# EAGLE design airu-bb (EAGLE 7.1.0)
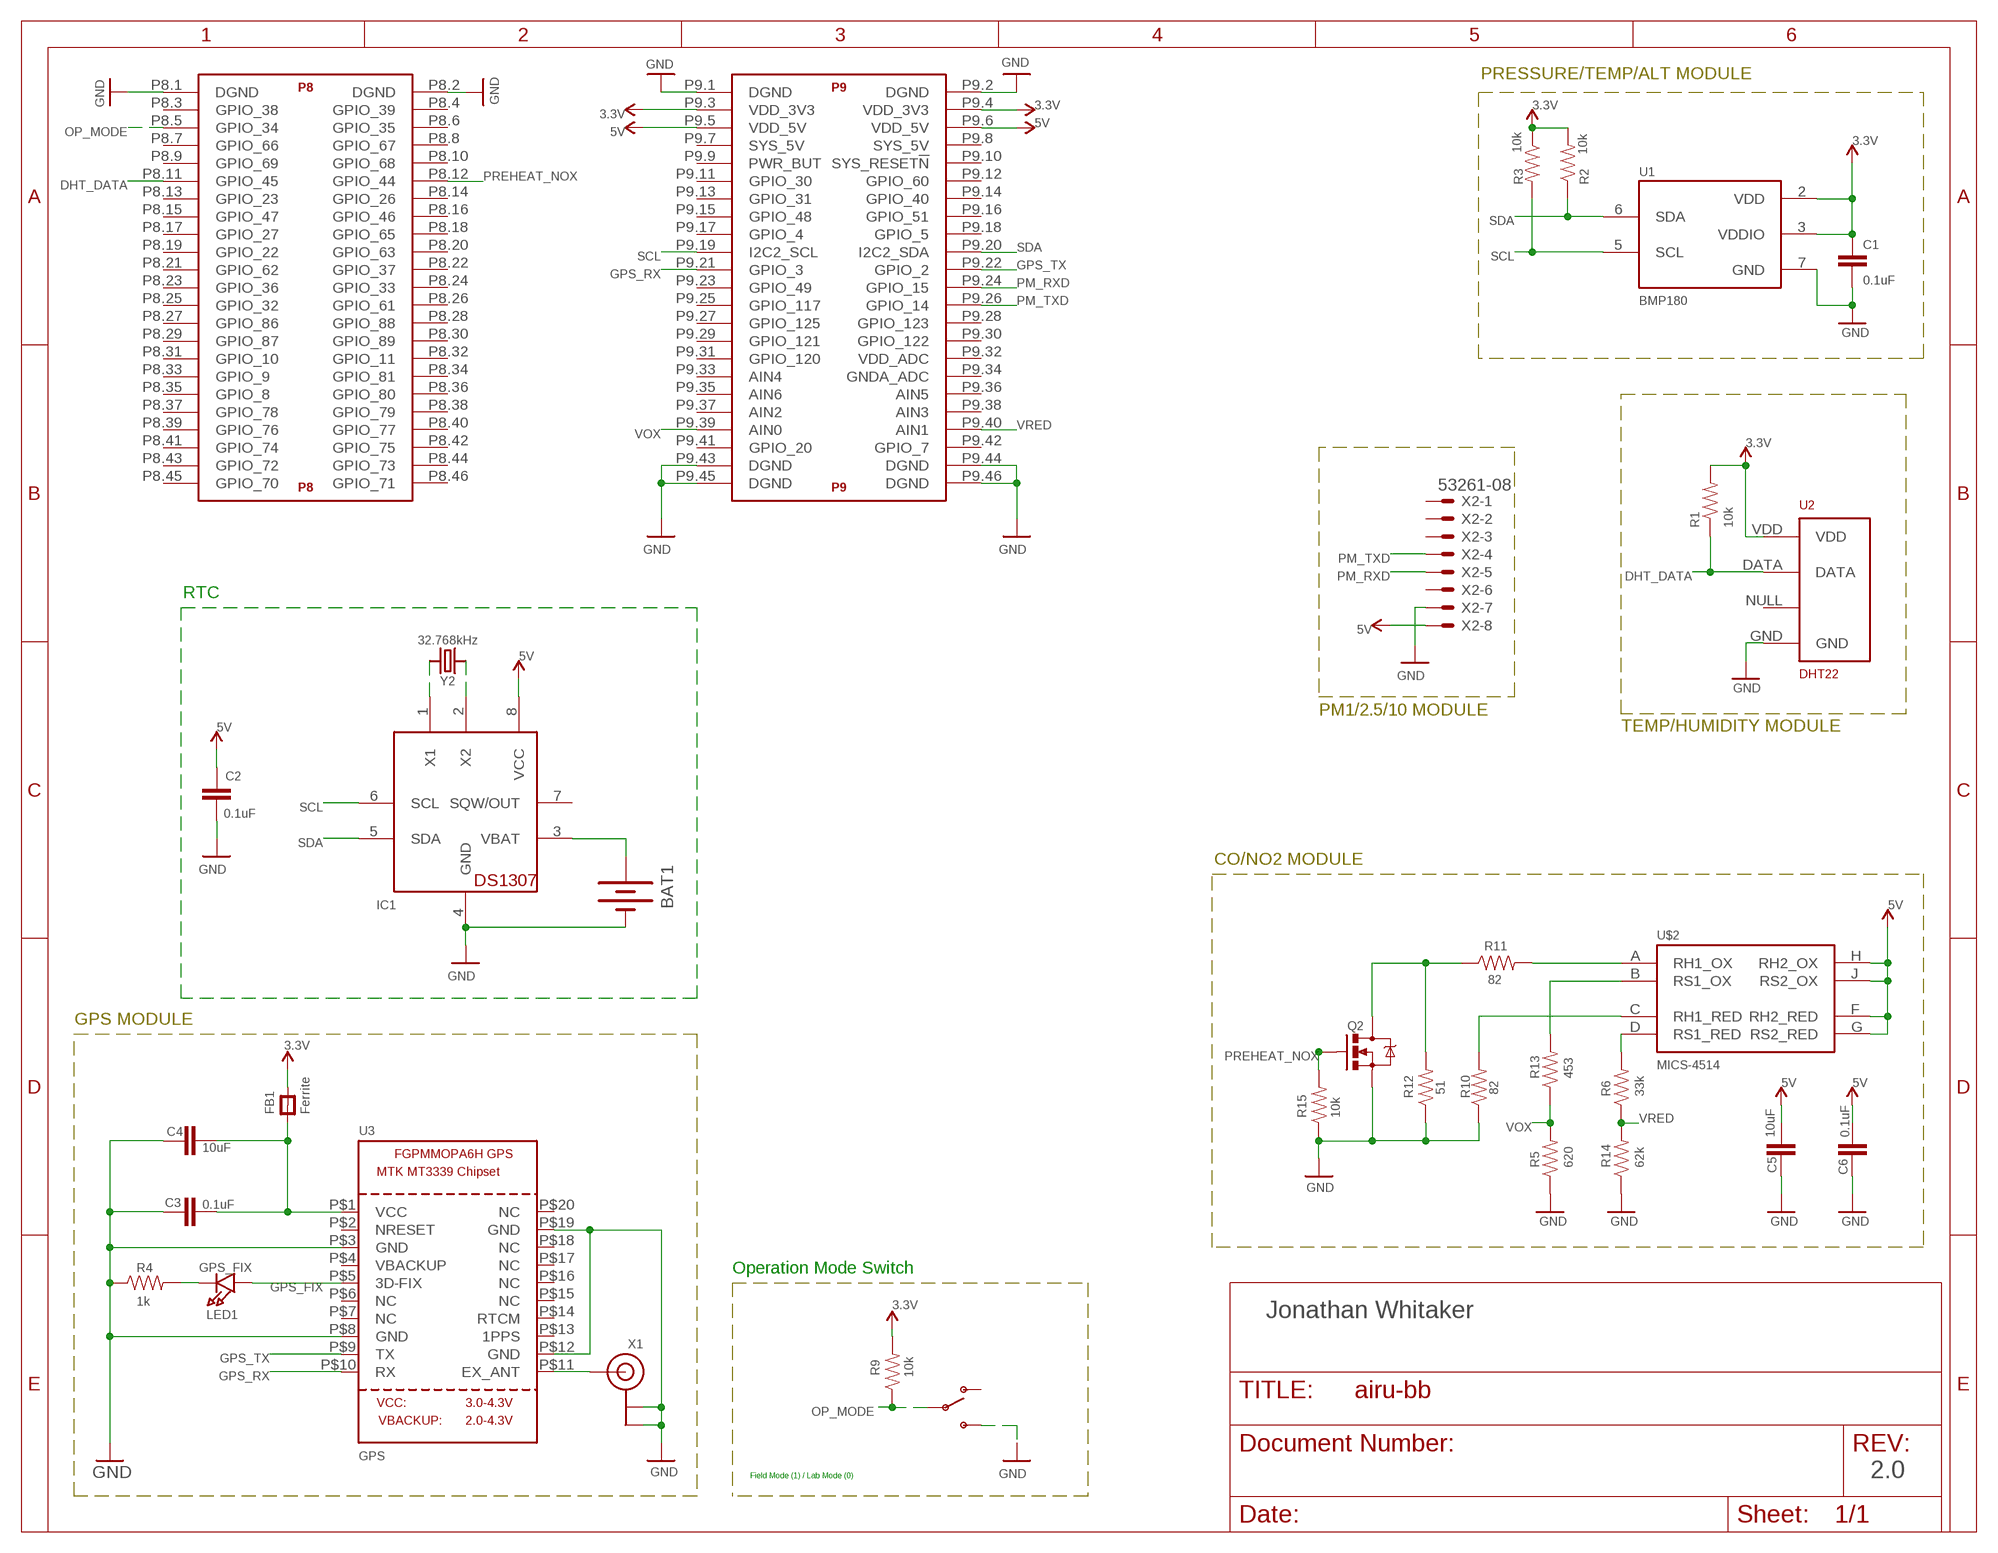
[diagram p0: schematic, sheet 1]

## Parts
BAT1  BATTERY20SMD  [BATTCON_20MM]
C1  0.1uF  CAP1206  [1206]
C2  0.1uF  CAP1206  [1206]
C3  0.1uF  CAP1206  [1206]
C4  10uF  CAP1206  [1206]
C5  10uF  CAP1206  [1206]
C6  0.1uF  CAP1206  [1206]
FB1  Ferrite  FERRITE0805  [0805]
IC1  DS1307  [DIL08]
LED1  GPS_FIX  LED1206  [CHIPLED_1206]
Q2  MOSFET-NCHANNELAO3404A  [SOT23-3]
R1  10k  RESISTOR1206  [1206]
R2  10k  RESISTOR1206  [1206]
R3  10k  RESISTOR1206  [1206]
R4  1k  RESISTOR1206  [1206]
R5  620  RESISTOR1206  [1206]
R6  33k  RESISTOR1206  [1206]
R9  10k  RESISTOR1206  [1206]
R10  82  RESISTOR1206  [1206]
R11  82  RESISTOR1206  [1206]
R12  51  RESISTOR1206  [1206]
R13  453  RESISTOR1206  [1206]
R14  62k  RESISTOR1206  [1206]
R15  10k  RESISTOR1206  [1206]
U1  BMP180  [BMP180]
U2  DHT22  RHT03_DHT-22_AM2302  [RHT03_DHT-22]
U3  GPS  GPS_FGPMMOPA6H  [FGPMMOPA6H]
U$1  BEAGLE_BONE_BLACK_CAPE  [BEAGLE_BONE_BLACK_CAPE]
U$2  MICS-4514  [MICS_10-SMD]
U$3  SWITCH_SPDT  [KPS-1290]
X1  ANTENNA_U.FL  [U.FL]
X2  53261-08  [53261-08]
Y2  32.768kHz  FX12232.768KHZ  [2-SMD]

## Nets
3.3V: C1.1 FB1.2 R1.2 R2.2 R3.1 R9.2 U1.2(VDD) U1.3(VDDIO) U2.VDD U$1.P9.3(P9:VDD_3V3) U$1.P9.4(P9:VDD_3V3) ; supply symbol labelled VCC
5V: C2.2 C5.2 C6.2 IC1.8(VCC) U$1.P9.5(P9:VDD_5V) U$1.P9.6(P9:VDD_5V) U$2.F(RH2_RED) U$2.G(RS2_RED) U$2.H(RH2_OX) U$2.J(RS2_OX) X2.8 ; supply symbol labelled VCC
DHT_DATA [DHT22 GND]: R1.1 U2.DATA U$1.P8.11(P8:GPIO_45)
GND [DHT22 GND]: BAT1.2(-) C1.2 C2.1 C3.1 C4.1 C5.1 C6.1 IC1.4(GND) Q2.2(S) R4.1 R5.1 R10.1 R12.1 R14.1 R15.1 U1.7(GND) U2.GND U3.P$3(GND) U3.P$8(GND) U3.P$12(GND) U3.P$19(GND) U$1.P8.1(P8:DGND) U$1.P8.2(P8:DGND) U$1.P9.1(P9:DGND) U$1.P9.2(P9:DGND) U$1.P9.43(P9:DGND) U$1.P9.44(P9:DGND) U$1.P9.45(P9:DGND) U$1.P9.46(P9:DGND) U$3.S X1.1(GND) X1.2(GND) X2.7
GPS_FIX: LED1.A U3.P$5(3D-FIX)
GPS_RX: U3.P$10(RX) U$1.P9.21(P9:GPIO_3)
GPS_TX: U3.P$9(TX) U$1.P9.22(P9:GPIO_2)
N$1: C3.2 C4.2 FB1.1 U3.P$1(VCC)
N$2: U3.P$11(EX_ANT) X1.3(SIGNAL)
N$3: LED1.C R4.2
N$4: R10.2 U$2.C(RH1_RED)
N$6: R13.2 U$2.B(RS1_OX)
N$7: Q2.3(D) R11.1 R12.2
N$8: R6.2 U$2.D(RS1_RED)
N$9: R11.2 U$2.A(RH1_OX)
N$11: BAT1.1(+) IC1.3(VBAT)
N$12: IC1.1(X1) Y2.1
N$14: IC1.2(X2) Y2.2
OP_MODE: R9.1 U$1.P8.5(P8:GPIO_34) U$3.P
PM_RXD: U$1.P9.24(P9:GPIO_15) X2.5
PM_TXD: U$1.P9.26(P9:GPIO_14) X2.4
PREHEAT_NOX: Q2.1(G) R15.2 U$1.P8.12(P8:GPIO_44)
SCL: IC1.6(SCL) R3.2 U1.5(SCL) U$1.P9.19(P9:I2C2_SCL)
SDA [BMP180 SCL/SDA]: IC1.5(SDA) R2.1 U1.6(SDA) U$1.P9.20(P9:I2C2_SDA)
VOX: R5.2 R13.1 U$1.P9.39(P9:AIN0)
VRED: R6.1 R14.2 U$1.P9.40(P9:AIN1)
Unconnected: IC1.7(SQW/OUT) U2.NULL U3.P$2(NRESET) U3.P$4(VBACKUP) U3.P$6(NC) U3.P$7(NC) U3.P$13(1PPS) U3.P$14(RTCM) U3.P$15(NC) U3.P$16(NC) U3.P$17(NC) U3.P$18(NC) U3.P$20(NC) U$1.P8.3(P8:GPIO_38) U$1.P8.4(P8:GPIO_39) U$1.P8.6(P8:GPIO_35) U$1.P8.7(P8:GPIO_66) U$1.P8.8(P8:GPIO_67) U$1.P8.9(P8:GPIO_69) U$1.P8.10(P8:GPIO_68) U$1.P8.13(P8:GPIO_23) U$1.P8.14(P8:GPIO_26) U$1.P8.15(P8:GPIO_47) U$1.P8.16(P8:GPIO_46) U$1.P8.17(P8:GPIO_27) U$1.P8.18(P8:GPIO_65) U$1.P8.19(P8:GPIO_22) U$1.P8.20(P8:GPIO_63) U$1.P8.21(P8:GPIO_62) U$1.P8.22(P8:GPIO_37) U$1.P8.23(P8:GPIO_36) U$1.P8.24(P8:GPIO_33) U$1.P8.25(P8:GPIO_32) U$1.P8.26(P8:GPIO_61) U$1.P8.27(P8:GPIO_86) U$1.P8.28(P8:GPIO_88) U$1.P8.29(P8:GPIO_87) U$1.P8.30(P8:GPIO_89) U$1.P8.31(P8:GPIO_10) U$1.P8.32(P8:GPIO_11) U$1.P8.33(P8:GPIO_9) U$1.P8.34(P8:GPIO_81) U$1.P8.35(P8:GPIO_8) U$1.P8.36(P8:GPIO_80) U$1.P8.37(P8:GPIO_78) U$1.P8.38(P8:GPIO_79) U$1.P8.39(P8:GPIO_76) U$1.P8.40(P8:GPIO_77) U$1.P8.41(P8:GPIO_74) U$1.P8.42(P8:GPIO_75) U$1.P8.43(P8:GPIO_72) U$1.P8.44(P8:GPIO_73) U$1.P8.45(P8:GPIO_70) U$1.P8.46(P8:GPIO_71) U$1.P9.7(P9:SYS_5V) U$1.P9.8(P9:SYS_5V) U$1.P9.9(P9:PWR_BUT) U$1.P9.10(P9:SYS_RESET!N) U$1.P9.11(P9:GPIO_30) U$1.P9.12(P9:GPIO_60) U$1.P9.13(P9:GPIO_31) U$1.P9.14(P9:GPIO_40) U$1.P9.15(P9:GPIO_48) U$1.P9.16(P9:GPIO_51) U$1.P9.17(P9:GPIO_4) U$1.P9.18(P9:GPIO_5) U$1.P9.23(P9:GPIO_49) U$1.P9.25(P9:GPIO_117) U$1.P9.27(P9:GPIO_125) U$1.P9.28(P9:GPIO_123) U$1.P9.29(P9:GPIO_121) U$1.P9.30(P9:GPIO_122) U$1.P9.31(P9:GPIO_120) U$1.P9.32(P9:VDD_ADC) U$1.P9.33(P9:AIN4) U$1.P9.34(P9:GNDA_ADC) U$1.P9.35(P9:AIN6) U$1.P9.36(P9:AIN5) U$1.P9.37(P9:AIN2) U$1.P9.38(P9:AIN3) U$1.P9.41(P9:GPIO_20) U$1.P9.42(P9:GPIO_7) U$3.O X2.1 X2.2 X2.3 X2.6

## Notes on the sheet
- PRESSURE/TEMP/ALT MODULE
- RTC
- PM1/2.5/10 MODULE
- TEMP/HUMIDITY MODULE
- CO/NO2 MODULE
- GPS MODULE
- Operation Mode Switch
- Jonathan Whitaker
- Field Mode (1) / Lab Mode (0) | 2.0

## Library data of the parts
BAT1 = SparkFun-Electromechanical:BATTERY: Battery Holders Various common sizes : AA, AAA, 18650 (PRT-12895), 20mm coin cell and 12mm coin cell. 20MM_4LEGS, BATT-10373
C1-C6 = SparkFun-Passives:CAP: Capacitor Standard 0603 ceramic capacitor, and 0.1" leaded capacitor.
FB1 = microbuilder:FERRITE: Ferrite Bead 0603 MMZ1608B121C - 120 Ohm @ 100MHz, 600mA, 0.15 Ohm DC Resistance - Digikey: 445-2164-1-ND BK1608HW121-T - 120 Ohm, 600mA Ferrite Chip - Digikey: 587-1876-2-ND 0805 HZ0805B272R-10 - 2.7K Ohm @ 100MHz, 200mA, 0.8 Ohm DC Resistance - Digikey: 240-2504-1-ND (see also Murata BLM21BD272SN1L) MMZ2012Y152B - 1.5K Ohm @ 100MHz, 500mA, 0.4 Ohm DC Resistance - Digikey: 445-1560-1-ND - Mainly for high frequency (80-400MHz) MMZ2012R102A - 1K Ohm @ 100MHz, 500mA, 0.3 Ohm DC Resistance - Digikey: 445-1555-2-ND - More general purpose (10-200MHz)
IC1 = adafruit:DS1307: DS1307 Real time clock (RTC) with battery backup ability. Talk to it via i2c
LED1 = microbuilder:LED: LED 0603 - 0603 Surface Mount Package 2mA: Green LED - Low Power (3.9mcd, 2ma, 1.7Vf) - Digikey: 475-2709-2-ND Orange LED - Low Power (9.8mcd, 2ma, 1.8Vf) - Digikey: 475-1194-2-ND Red LED - Low Power (5mcd, 2ma, 1.8Vf) - Digikey: 475-1195-2-ND Yellow LED - Low Power (7mcd, 2ma, 1.8Vf) - Digikey: 475-1196-2-ND 5mA: Blue LED - Low Power (17mcd, 5ma, 2.9Vf) - Digikey: LNJ937W8CRACT-ND 0805 - 0805 Surface Mount Package 2mA: Red LED (8.8mcd, 2mA, 1.8Vf, Clear) - Low Power [Digikey: 475-2510-1-ND] Green LED (5mcd, 2mA, 1.8Vf, Clear) - Low Power [Digikey: 475-2730-1-ND] Yellow LED (11.3mcd, 2mA, 1.8Vf, Clear) - Low Power [Digikey: 475-2555-1-ND] 20mA: Red LED (104mcd, 20mA, Diffused) - LS R976 [Digikey: 475-1278-6-ND] Red LED (12mcd, 20mA, 2.0Vf, Clear) - APT2012EC [Digikey: 754-1128-1-ND] Green LED (15mcd, 20mA, 2.2Vf, Clear) - APT2012GC [Digikey: 754-1131-1-ND] Orange LED (160mcd, 20mA, 2.1Vf, Clear) - APT2012SECK [Digikey: 754-1130-1-ND] 1206 - 1206 Surface Mount Package Green LED (26mcd, 20mA, Diffused) - LG N971 [Digikey: 475-1407-6-ND] Red LED (15mcd, 20mA, Diffused) - LH N974 [Digikey: 475-1416-6-ND]
Q2 = SparkFun-DiscreteSemi:MOSFET-NCHANNEL: Common NMOSFET Parts MFG P/N Store ID Prod ID FDD8780 TRANS-09984 SI7820DN TRANS-11055 FDS6630A IC-08089 2N7002PW TRANS-11151 FQP30N06L COM-10213 TRANS-10060 BSS123LT1G TRANS-08345 BSS138 TRANS-00830 BS170 2N7000; PROD_ID: TRAN-12988
R1-R6 R9-R15 = SparkFun-Passives:RESISTOR: Resistor Basic schematic elements and footprints for 0603, 1206, and PTH resistors.
U1 = SparkFun-Sensors:BMP180: BOSCH BMP180 DIGITAL BAROMETRIC PRESSURE SENSOR Web page: http://www.bosch-sensortec.com/en/homepage/products_3/environmental_sensors_1/bmp180_1/bmp180 Datasheet: http://ae-bst.resource.bosch.com/media/products/dokumente/bmp180/BST-BMP180-DS000-09.pdf The BMP180 is the function compatible successor of the BMP085, a new generation of high precision digital pressure sensors for consumer applications. The ultra-low power, low voltage electronics of the BMP180 is optimized for use in mobile phones, PDAs, GPS navigation devices and outdoor equipment. With a low altitude noise of merely 0.25m at fast conversion time, the BMP180 offers superior performance. The I2C interface allows for easy system integration with a microcontroller. The BMP180 is based on piezo-resistive technology for EMC robustness, high accuracy and linearity as well as long term stability. Key features: - Temperature measurement included - I2C interface - Fully calibrated - Pb-free, halogen-free and RoHS compliant, - MSL 1 Basic specs: Pressure range: 300 to 1100hPa (+9000m to -500m relating to sea level) Supply voltage: 1.8 to 3.6V (VDD), 1.62V to 3.6V (VDDIO) Package: LGA package with metal lid Small footprint: 3.6mm x 3.8mm Super-flat: 0.93mm height Low power: 5μA at 1 sample / sec. in standard mode Low noise: 0.06hPa (0.5m) in ultra low power mode, 0.02hPa (0.17m) advanced resolution mode Typical applications: - Enhancement of GPS navigation (dead-reckoning, slope detection, etc.) - In- and out-door navigation - Leisure and sports - Weather forecast - Vertical velocity indication (rise/sink speed)
U2 = RHT03_DHT-22_AM2302:RHT03_DHT-22_AM2302: RHT03 / DHT-22 / AM2302 Packages and symbol for the RHT03 / DHT-22 relative humidity and temperature sensor. Note: The AM2302 is a wired version of the DHT-22 which typically requires less clearance and is thus provided as a separate package.; PROD_ID: SEN-10167
U3 = adafruit:GPS_FGPMMOPA6H: GPS Module - MTK MT3339 Chipset, -165dBm sensitivity, 22 channels, 10Hz, auto-select external antenna options
U$1 = SparkFun-Boards:BEAGLE_BONE_BLACK_CAPE
U$2 = SparkFun-Sensors:MICS-4514: Metal oxide MEMS carbon monoxide (CO) and NOx sensor in an SMD package.; PROD_ID: COMP-12310
U$3 = SparkFun-Electromechanical:SWITCH_SPDT: SWCH-10651 Side-actuated SPDT slide switch, as used on the Arduino Pro; PROD_ID: SWCH-10651
X1 = adafruit:ANTENNA_U.FL: U.FL Antenna Connector
X2 = con-molex:53?-08: CONNECTOR wire to board 1.25 mm (.049 inch) pitch header; OC_FARNELL: 1125376; OC_NEWARK: unknown
Y2 = Lowduino:FX122: FX122 - SMD 2.0 x 1.2 Tuning Fork Crystal Technical Specifications: Frequency: 32.768 kHz Frequency Tolerance @ 25ºC: ±20 PPM Frequency Stability Temperature Coefficient: -0.04 PPM / (ΔºC)^2 0.6mm Height Long Term Stability http://www.foxonline.com/pdfs/FX122.pdf; DIGIKEY: 631-1261-1-ND

## Net classes
0 default: width 0.254 mm
1 ground: width 0.457 mm
2 vcc: width 0.457 mm
3 BMP180 GND: width 0.152 mm, clearance 0.152 mm
4 BMP180 SCL/SDA: width 0.127 mm, clearance 0.127 mm
5 DHT22 GND: width 0.003 mm, clearance 0.127 mm

## Board
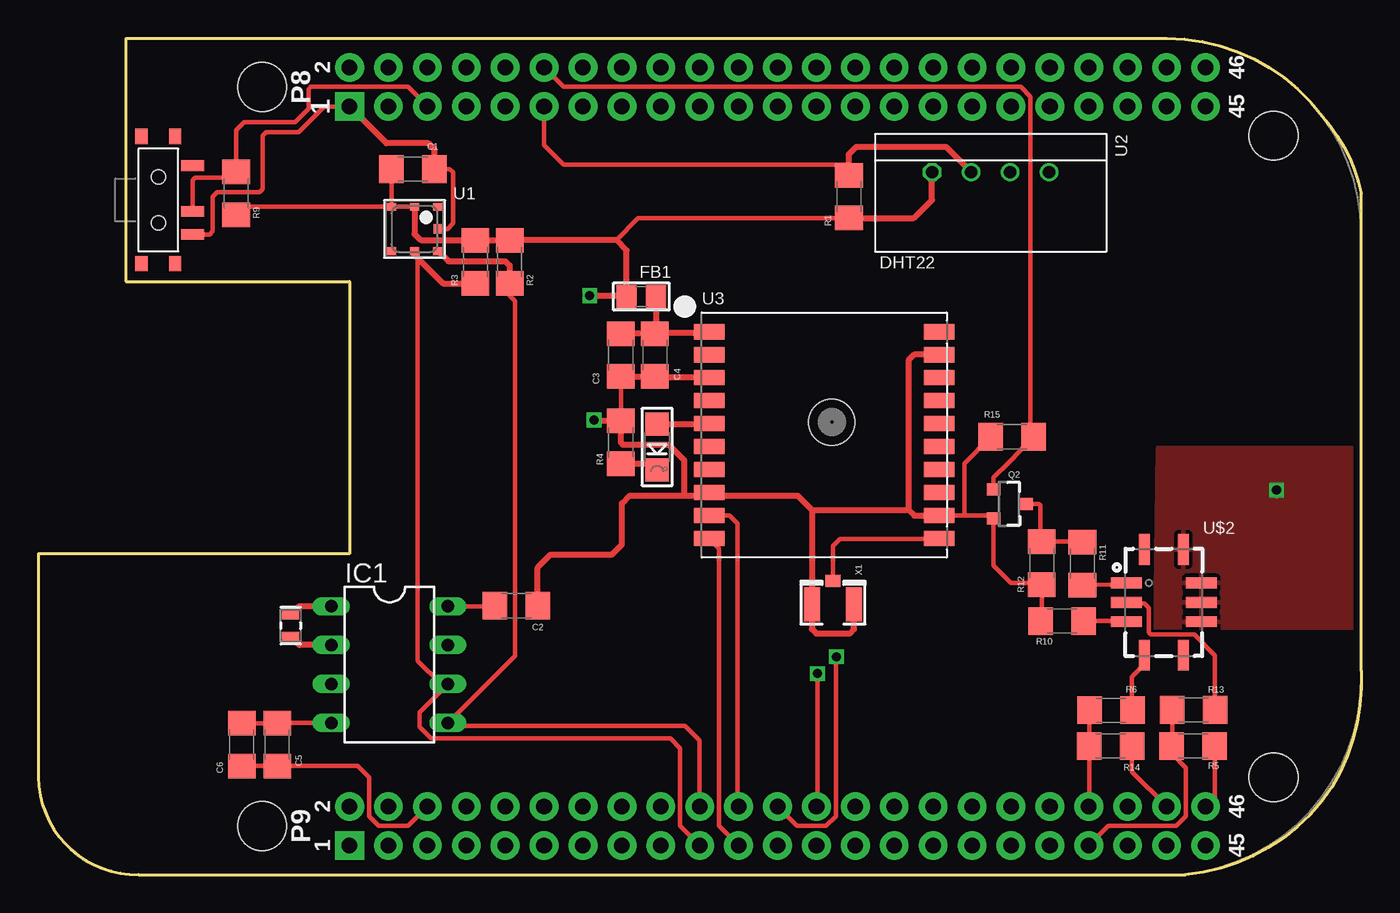
[diagram p1: board, top side]
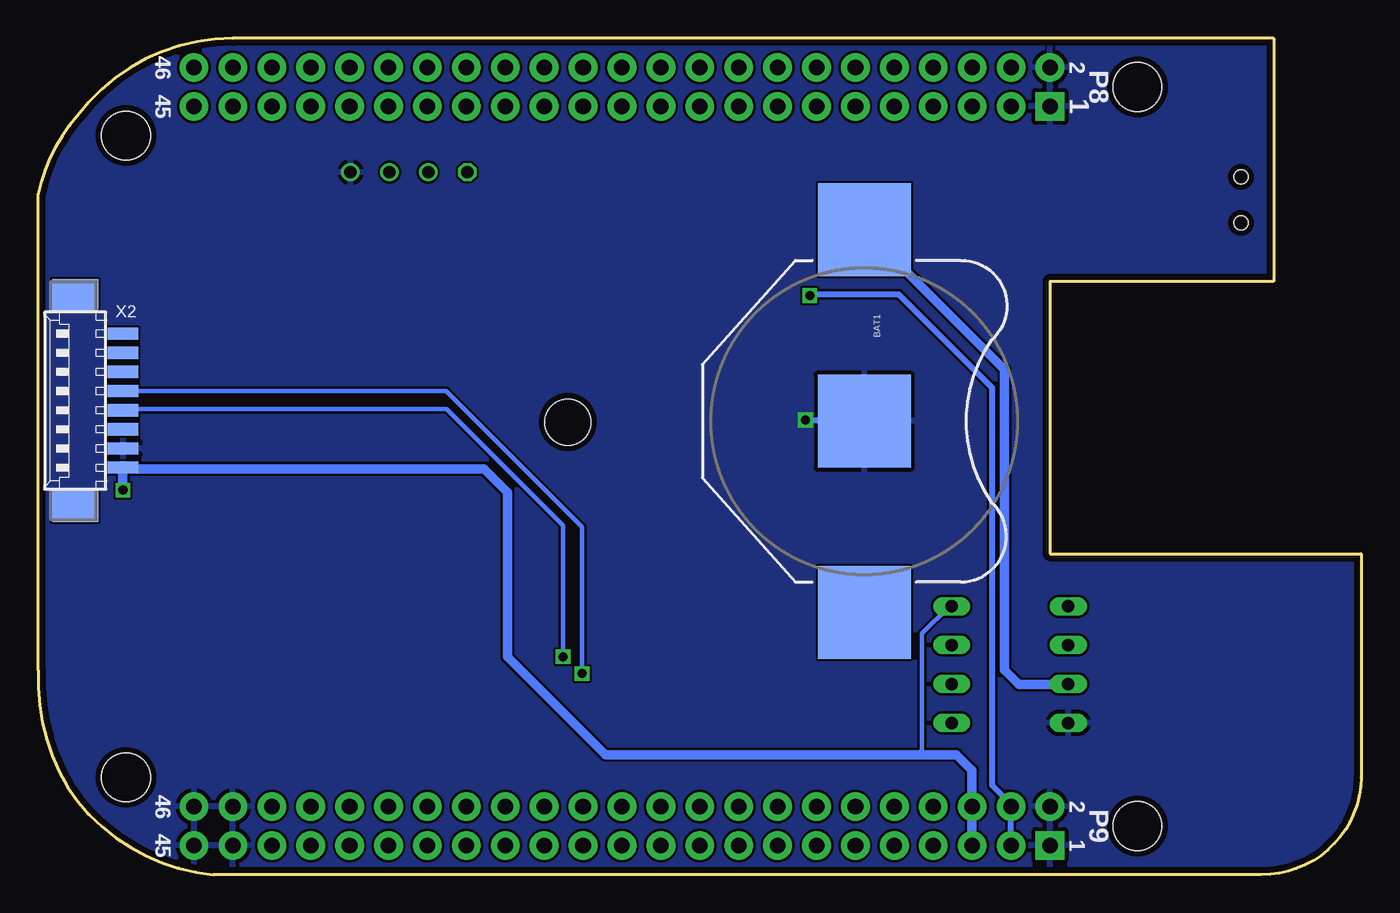
[diagram p2: board, bottom side, seen from below]

Size 86.37 x 54.61 mm. Coordinates in mm from the lower left corner, seen from the top.
Outline: 5.71,54.61 5.71,38.73 20.32,38.73 20.32,20.95 0,20.95 0,6.35 arc90 6.54,0 74.93,0 arc51 84.45,5.71 arc33 86.36,13.34 86.36,44.45 arc30 83.82,49.53 arc53 73.66,54.61 5.71,54.61
Copper layers (1*16): Top 0.0356mm / dielectric 1.5011mm / Bottom 0.0356mm
Design rules "osh-park": minimum track width 6mil, minimum drill 13mil, track to track 6mil, track to pad 6mil, pad to pad 6mil, via to via 6mil, smd to smd 6mil, copper to edge 15mil, drill to drill 6mil, minimum pad ring 7mil, minimum via ring 7mil, stop-mask expansion 3mil, vias tented up to drill 0mil, thermal gap 10mil

### Footprints (pad centres in the part's own frame; a part is rotated, then mirrored left to right if it is on the bottom)
BATTCON_20MM = smd 6.07 x 6.07: 1 -12.5,0; 2 0,0; 3 12.5,0
1206 = smd 1.6 x 1.8: 1 -1.4,0; 2 1.4,0
0805 = smd 1.3 x 1.5: 1 -0.95,0; 2 0.95,0
DIL08 = drill 0.813 long: 1 -3.81,-3.81; 2 -1.27,-3.81; 3 1.27,-3.81; 4 3.81,-3.81; 5 3.81,3.81; 6 1.27,3.81; 7 -1.27,3.81; 8 -3.81,3.81
CHIPLED_1206 = smd 1.5 x 1.5: A 0,-1.496; C 0,1.496
SOT23-3 = smd 0.8 x 0.9: 1 -0.95,-1; 2 0.95,-1; 3 0,1.1
BMP180 = smd 0.6 x 0.5: 1 1.5,1.45; 2 0,1.45; 3 -1.5,1.45; 4 -1.5,-1.45; 5 0,-1.45; 6 1.5,-1.45 | smd 0.5 x 0.6: 7 1.5,0
RHT03_DHT-22 = drill 0.8: DATA -1.27,0; GND 3.81,0; NULL 1.27,0 | drill 0.8 octagon: VDD -3.81,0
FGPMMOPA6H = smd 2 x 1: P$1 -7.5,6.75; P$2 -7.5,5.25; P$3 -7.5,3.75; P$4 -7.5,2.25; P$5 -7.5,0.75; P$6 -7.5,-0.75; P$7 -7.5,-2.25; P$8 -7.5,-3.75; P$9 -7.5,-5.25; P$10 -7.5,-6.75; P$11 7.5,-6.75; P$12 7.5,-5.25; P$13 7.5,-3.75; P$14 7.5,-2.25; P$15 7.5,-0.75; P$16 7.5,0.75; P$17 7.5,2.25; P$18 7.5,3.75; P$19 7.5,5.25; P$20 7.5,6.75 | hole 3: 0.5,0.85
BEAGLE_BONE_BLACK_CAPE = drill 1.016 pad 1.88 square: P8.1 20.32,50.165; P9.1 20.32,1.905 | drill 1.016 pad 1.88: P8.2 20.32,52.705; P8.3 22.86,50.165; P8.4 22.86,52.705; P8.5 25.4,50.165; P8.6 25.4,52.705; P8.7 27.94,50.165; P8.8 27.94,52.705; P8.9 30.48,50.165; P8.10 30.48,52.705; P8.11 33.02,50.165; P8.12 33.02,52.705; P8.13 35.56,50.165; P8.14 35.56,52.705; P8.15 38.1,50.165; P8.16 38.1,52.705; P8.17 40.64,50.165; P8.18 40.64,52.705; P8.19 43.18,50.165; P8.20 43.18,52.705; P8.21 45.72,50.165; P8.22 45.72,52.705; P8.23 48.26,50.165; P8.24 48.26,52.705; P8.25 50.8,50.165; P8.26 50.8,52.705; P8.27 53.34,50.165; P8.28 53.34,52.705; P8.29 55.88,50.165; P8.30 55.88,52.705; P8.31 58.42,50.165; P8.32 58.42,52.705; P8.33 60.96,50.165; P8.34 60.96,52.705; P8.35 63.5,50.165; P8.36 63.5,52.705; P8.37 66.04,50.165; P8.38 66.04,52.705; P8.39 68.58,50.165; P8.40 68.58,52.705; P8.41 71.12,50.165; P8.42 71.12,52.705; P8.43 73.66,50.165; P8.44 73.66,52.705; P8.45 76.2,50.165; P8.46 76.2,52.705; P9.2 20.32,4.445; P9.3 22.86,1.905; P9.4 22.86,4.445; P9.5 25.4,1.905; P9.6 25.4,4.445; P9.7 27.94,1.905; P9.8 27.94,4.445; P9.9 30.48,1.905; P9.10 30.48,4.445; P9.11 33.02,1.905; P9.12 33.02,4.445; P9.13 35.56,1.905; P9.14 35.56,4.445; P9.15 38.1,1.905; P9.16 38.1,4.445; P9.17 40.64,1.905; P9.18 40.64,4.445; P9.19 43.18,1.905; P9.20 43.18,4.445; P9.21 45.72,1.905; P9.22 45.72,4.445; P9.23 48.26,1.905; P9.24 48.26,4.445; P9.25 50.8,1.905; P9.26 50.8,4.445; P9.27 53.34,1.905; P9.28 53.34,4.445; P9.29 55.88,1.905; P9.30 55.88,4.445; P9.31 58.42,1.905; P9.32 58.42,4.445; P9.33 60.96,1.905; P9.34 60.96,4.445; P9.35 63.5,1.905; P9.36 63.5,4.445; P9.37 66.04,1.905; P9.38 66.04,4.445; P9.39 68.58,1.905; P9.40 68.58,4.445; P9.41 71.12,1.905; P9.42 71.12,4.445; P9.43 73.66,1.905; P9.44 73.66,4.445; P9.45 76.2,1.905; P9.46 76.2,4.445 | hole 3.175: 14.605,3.175; 80.645,6.35; 80.645,48.26; 14.605,51.435
MICS_10-SMD = smd 0.7 x 2: A 1.27,2.45; B 0,2.45; C -1.27,2.45; F -1.27,-2.45; G 0,-2.45; H 1.27,-2.45 | smd 2 x 0.7: D -3.45,1.27; E -3.45,-1.27; J 3.45,-1.27; K 3.45,1.27
KPS-1290 = smd 0.7 x 1.5: O -2.25,2.25; P 0.75,2.25; S 2.25,2.25 | smd 1 x 0.8: P$1 -4.15,1.1; P$2 -4.15,-1.1; P$3 4.15,-1.1; P$4 4.15,1.1 | hole 0.9: -1.5,0; 1.5,0
U.FL = smd 2.2 x 1.05: 1 0,1.375; 2 0,-1.375 | smd 0.8 x 1: 3 1.525,0
53261-08 = smd 0.8 x 2: 1 4.375,-2.5; 2 3.125,-2.5; 3 1.875,-2.5; 4 0.625,-2.5; 5 -0.625,-2.5; 6 -1.875,-2.5; 7 -3.125,-2.5; 8 -4.375,-2.5 | smd 2.1 x 3: S1 6.875,0.625; S2 -6.875,0.625
2-SMD = smd 0.6 x 1.1: 1 -0.7,0; 2 0.7,0

### Placement (x,y rotation side)
BAT1  32.44,29.61 270 bottom
C1  24.46,46.06 0 top
C2  31.2,17.56 180 top
C3  38.03,33.93 90 top
C4  40.26,33.93 90 top
C5  15.6,8.49 270 top
C6  13.28,8.49 270 top
FB1  39.37,37.75 180 top
IC1  22.93,13.72 270 top
LED1  40.4,27.92 180 top
Q2  63.37,24.2 270 top
R1  52.92,44.27 270 top
R2  30.77,40.02 90 top
R3  28.54,40.02 270 top
R4  38.03,28.23 270 top
R5  75.4,8.4 180 top
R6  70.03,10.74 0 top
R9  12.92,44.48 270 top
R10  66.84,16.56 0 top
R11  68.16,20.3 270 top
R12  65.51,20.34 90 top
R13  75.42,10.76 0 top
R14  70.01,8.4 180 top
R15  63.57,28.59 0 top
U1  24.56,42.16 0 top
U2  62.17,45.87 0 top
U3  51.31,28.7 0 top
U$1  0,0 0 top
U$2  73.48,17.78 90 top
U$3  7.84,44.05 270 top
X1  51.88,17.65 90 top
X2  83.33,30.95 90 bottom
Y2  16.47,16.26 270 top

### Tracks (layer width: path | path; a pad name or v marks a point on that pad's centre or on a via)
3.3V  (via drill 0.6)
  Top 0.305: U1.3 13.44,43.61 R9.2 | U1.3 C1.1 | U1.3 U1.2 | R1.2 39.17,42.87 37.73,41.44
  Top 0.406: R1.2 57.16,42.87 58.34,44.05 58.34,45.85 U2.VDD | U1.2 24.57,41.84 24.96,41.44 28.52,41.44 R3.1 R2.2 | R2.2 | R2.2 30.79,41.44 37.73,41.44 38.42,40.76 FB1.2 38.36,37.81 v35.99,37.81
  Bottom 0.406: U$1.P9.3 U$1.P9.4 22.86,4.57 24.09,5.8 24.09,31.79 30.19,37.88 35.92,37.88 v35.99,37.81
5V  (via drill 0.6)
  Top 0.305: C6.2 C5.2 20.85,7.09 21.59,6.35 21.59,3.81 22.23,3.17 24.13,3.17 U$1.P9.6 | IC1.8 29.77,17.52 C2.2
  Top 0.61: v80.84,25.11 80.84,24.89
  Bottom 0.305: IC1.8 26.89,17.52 28.66,15.75 28.66,8.13 28.95,7.84
  Bottom 0.61: v80.84,25.11 80.84,26.57 X2.8 80.74,26.49 57.26,26.49 55.73,24.96 55.73,14.22 49.35,7.84 28.95,7.84 26.41,7.84 25.4,6.82 U$1.P9.6 U$1.P9.5
  pour Top: 86.28,16.11 72.93,16.11 73.08,27.87 86.43,27.87 86.43,17.85
DHT_DATA
  Top 0.305: U$1.P8.11 33.02,47.62 34.29,46.35 52.79,46.35 52.92,46.23
  Top 0.406: R1.1 52.92,46.23 52.92,47.04 53.41,47.53 59.24,47.53 U2.DATA
GND  (via drill 0.6)
  Top 0.305: U$1.P8.1 20.3,50.14 18.65,50.14 16.98,48.48 14.88,48.48 14.66,48.26 14.66,44.77 14.44,44.56 11.68,44.56 11.39,44.27 11.39,42.02 11.18,41.8 U$3.S | IC1.4 15.62,9.9 | C5.1 C6.1 | C1.2 26.87,46.06 27.07,45.86 27.07,42.52 26.7,42.16 U1.7 | R5.1 76.8,5.04 U$1.P9.46 | R14.1 71.41,6.7 U$1.P9.44 | R12.1 | R12.1 65.4,19.05 63.5,19.05 62.37,20.18 Q2.2 62.17,23.45 60.45,23.45 | U3.P$12 60.45,23.45 | R15.1 62.17,28.57 60.45,26.85 60.45,23.45 | R12.1 65.51,16.63 R10.1 | C3.1 R4.1
  Top 0.406: C1.2 25.86,47.36 25.47,47.75 22.73,47.75 U$1.P8.1 | C3.1 C4.1 | C4.1 | 15.62,9.9 C5.1 | U3.P$3 40.33,32.45 C4.1 | C2.1 32.6,20.05 33.45,20.9 37.45,20.9 38.1,21.55 38.1,24.24 38.61,24.75 42.16,24.75 | 42.16,24.75 43.6,24.75 | 43.6,24.75 U3.P$8 | 42.16,24.75 42.16,27.07 41.15,28.08 38.17,28.08 38.03,28.23 R4.1 36.33,29.63 v36.28,29.68 | 43.6,24.75 49.56,24.75 50.51,23.8 | 50.51,23.8 X1.1 50.5,16.04 50.8,15.75 52.97,15.75 53.27,16.04 53.27,17.63 X1.2 | U3.P$19 57.17,33.95 56.82,33.6 56.82,23.95 | 56.82,23.95 56.82,23.8 57.18,23.44 58.8,23.44 U3.P$12 | 50.51,23.8 56.67,23.8 56.82,23.95
  Bottom 0.406: v36.28,29.68 32.51,29.68 BAT1.2
  pour Bottom: 0,0.07 0,54.64 86.36,54.64 86.36,0 0,0
GPS_FIX
  Top 0.406: LED1.A 43.77,29.42 U3.P$5
GPS_RX
  Top 0.305: U$1.P9.21 44.45,3.17 44.45,21.31 U3.P$10
GPS_TX
  Top 0.305: U3.P$9 45.12,23.45 45.65,22.93 45.65,4.52
  Top 0.406: 45.65,4.52 U$1.P9.22
N$1
  Top 0.406: FB1.1 40.32,35.38 | 40.32,35.38 C4.2 C3.2 | C3.2 | 40.32,35.38 43.74,35.38 U3.P$1
N$2
  Top 0.305: X1.3 51.88,21.47 52.32,21.91 58.77,21.91 U3.P$11
N$3
  Top 0.406: R4.2 40,26.83 LED1.C
N$4
  Top 0.305: 71.01,16.5 U$2.C 70.98,16.56 R10.2
N$6
  Top 0.305: R13.2 76.82,14.33 75.47,15.68 72.64,15.68 72.5,15.82 72.5,17.42 72.2,17.71 71.1,17.71 U$2.B
N$7
  Top 0.305: R11.1 67.77,21.74 R12.2 65.41,21.84 65.41,24.13 65.33,24.2 Q2.3
N$8
  Top 0.305: U$2.D 72.21,13.72 71.41,12.92 71.41,10.76 R6.2
N$9
  Top 0.305: R11.2 70.95,18.97 U$2.A
N$11
  Bottom 0.61: IC1.3 19.16,12.41 22.35,12.41 23.29,13.35 23.29,32.96 BAT1.1
N$12
  Top 0.406: IC1.1 17.04,17.52 Y2.1
N$14
  Top 0.406: IC1.2 17.04,14.98 Y2.2
OP_MODE
  Top 0.305: U$1.P8.5 24.13,51.44 17.78,51.44 17.63,51.29 17.63,50 16.76,49.13 13.43,49.13 12.92,48.62 R9.1 12.53,45.5 10.23,45.5 10.09,45.35 U$3.P
PM_RXD  (via drill 0.6)
  Top 0.305: U$1.P9.24 49.53,3.17 51.44,3.17 52.07,3.81 52.07,14.22 v52.1,14.22
  Bottom 0.305: v52.1,14.22 52.1,22.79 59.72,30.41 80.75,30.41 X2.5
PM_TXD  (via drill 0.6)
  Top 0.305: v50.87,13.13 50.87,4.51 U$1.P9.26
  Bottom 0.305: X2.4 59.73,31.58 50.87,22.71 v50.87,13.13
PREHEAT_NOX
  Top 0.305: Q2.1 62.37,25.94 63.35,26.92 | 63.35,26.92 | 63.35,26.92 64.15,27.72 64.15,27.77 R15.2 64.77,28.79 64.77,50.8 64.14,51.44 34.29,51.44 U$1.P8.12
SCL
  Top 0.305: U$1.P9.19 41.91,3.17 41.91,8.26 41.27,8.89 25.65,8.89 24.89,9.65 24.89,10.6 IC1.6 26.29,12.45 24.77,13.97 24.77,40.51 U1.5
  Top 0.406: U1.5 24.57,40.46 26.41,38.61 28.52,38.61 R3.2
SDA
  Top 0.305: 26.78,9.94 IC1.5 | U$1.P9.20 43.18,8.78 42.23,9.72 26.92,9.72 IC1.5 | R2.1 30.77,37.81 31.11,37.47 31.11,14.28 IC1.5
  Top 0.406: U1.6 26.12,40.71 26.78,40.06 30.48,40.06 30.77,39.77 R2.1
VOX
  Top 0.305: R13.1 74.02,8.43 R5.2 74,7.92 74.93,6.99 74.93,3.81 74.3,3.17 69.85,3.17 U$1.P9.39
VRED
  Top 0.305: R6.1 68.63,8.42 R14.2 68.61,4.47 U$1.P9.40

### Text on the board
Document: Lab/Field